# EAGLE schematic Phi (EAGLE 6.4)

## Sheet 1 of 2
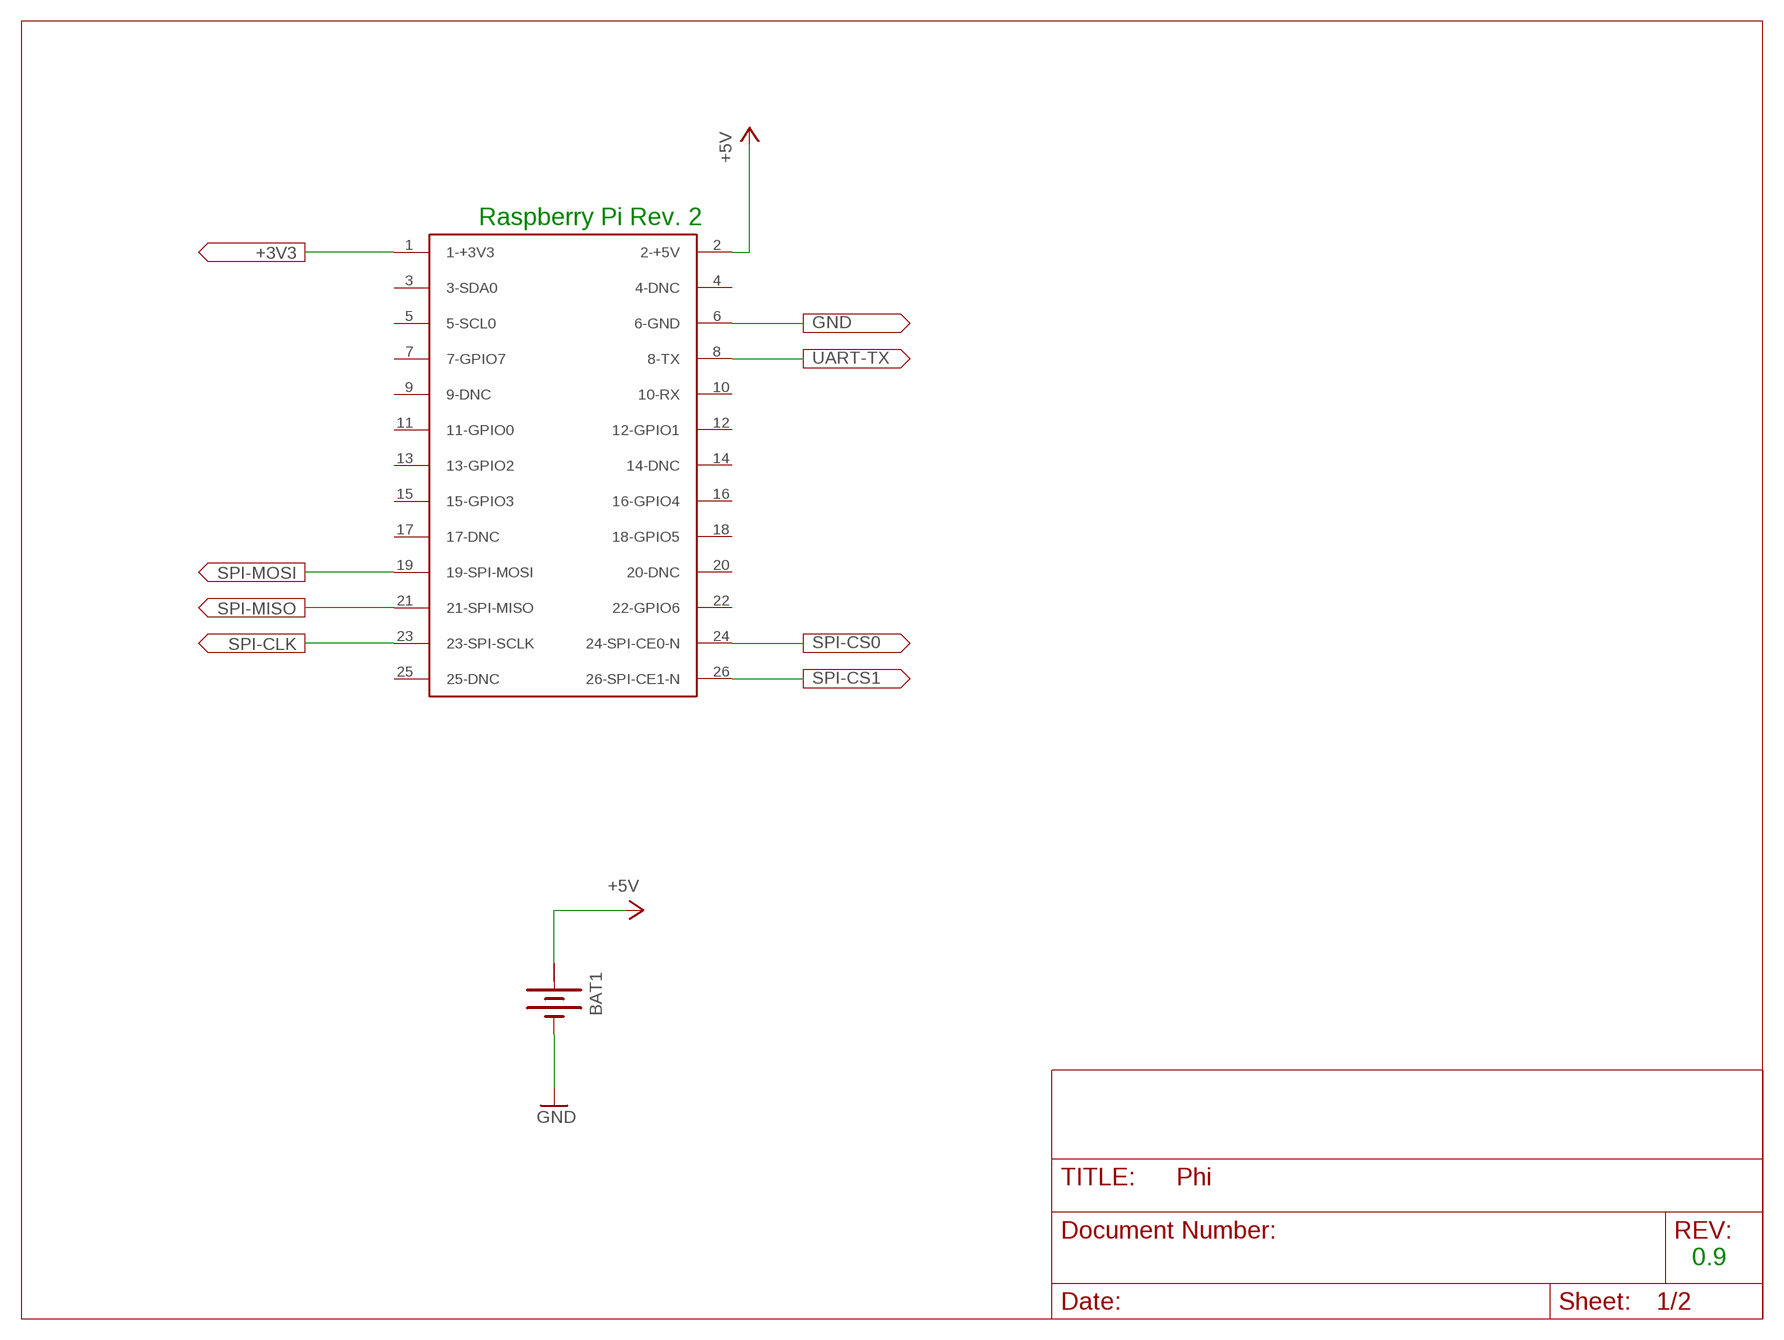
[diagram p0: schematic, sheet 1]

### Parts
BAT1  BATTERY  [BATTERY]
U$1  RASPBERRY-PI  [RASPBERRY-PI]

### Nets
+3V3: U$1.1(1-+3V3)
+5V: BAT1.+ U$1.2(2-+5V) ; also sheet 2
GND: BAT1.- ; also sheet 2
N$1: U$1.24(24-SPI-CE0-N)
N$3: U$1.26(26-SPI-CE1-N)
N$4: U$1.6(6-GND)
SPI-CLK: U$1.23(23-SPI-SCLK)
SPI-MISO: U$1.21(21-SPI-MISO)
SPI-MOSI: U$1.19(19-SPI-MOSI)
UART-TX: U$1.8(8-TX)
Unconnected: U$1.3(3-SDA0) U$1.4(4-DNC) U$1.5(5-SCL0) U$1.7(7-GPIO7) U$1.9(9-DNC) U$1.10(10-RX) U$1.11(11-GPIO0) U$1.12(12-GPIO1) U$1.13(13-GPIO2) U$1.14(14-DNC) U$1.15(15-GPIO3) U$1.16(16-GPIO4) U$1.17(17-DNC) U$1.18(18-GPIO5) U$1.20(20-DNC) U$1.22(22-GPIO6) U$1.25(25-DNC)

### Notes on the sheet
- Raspberry Pi Rev. 2
- 0.9

## Sheet 2 of 2
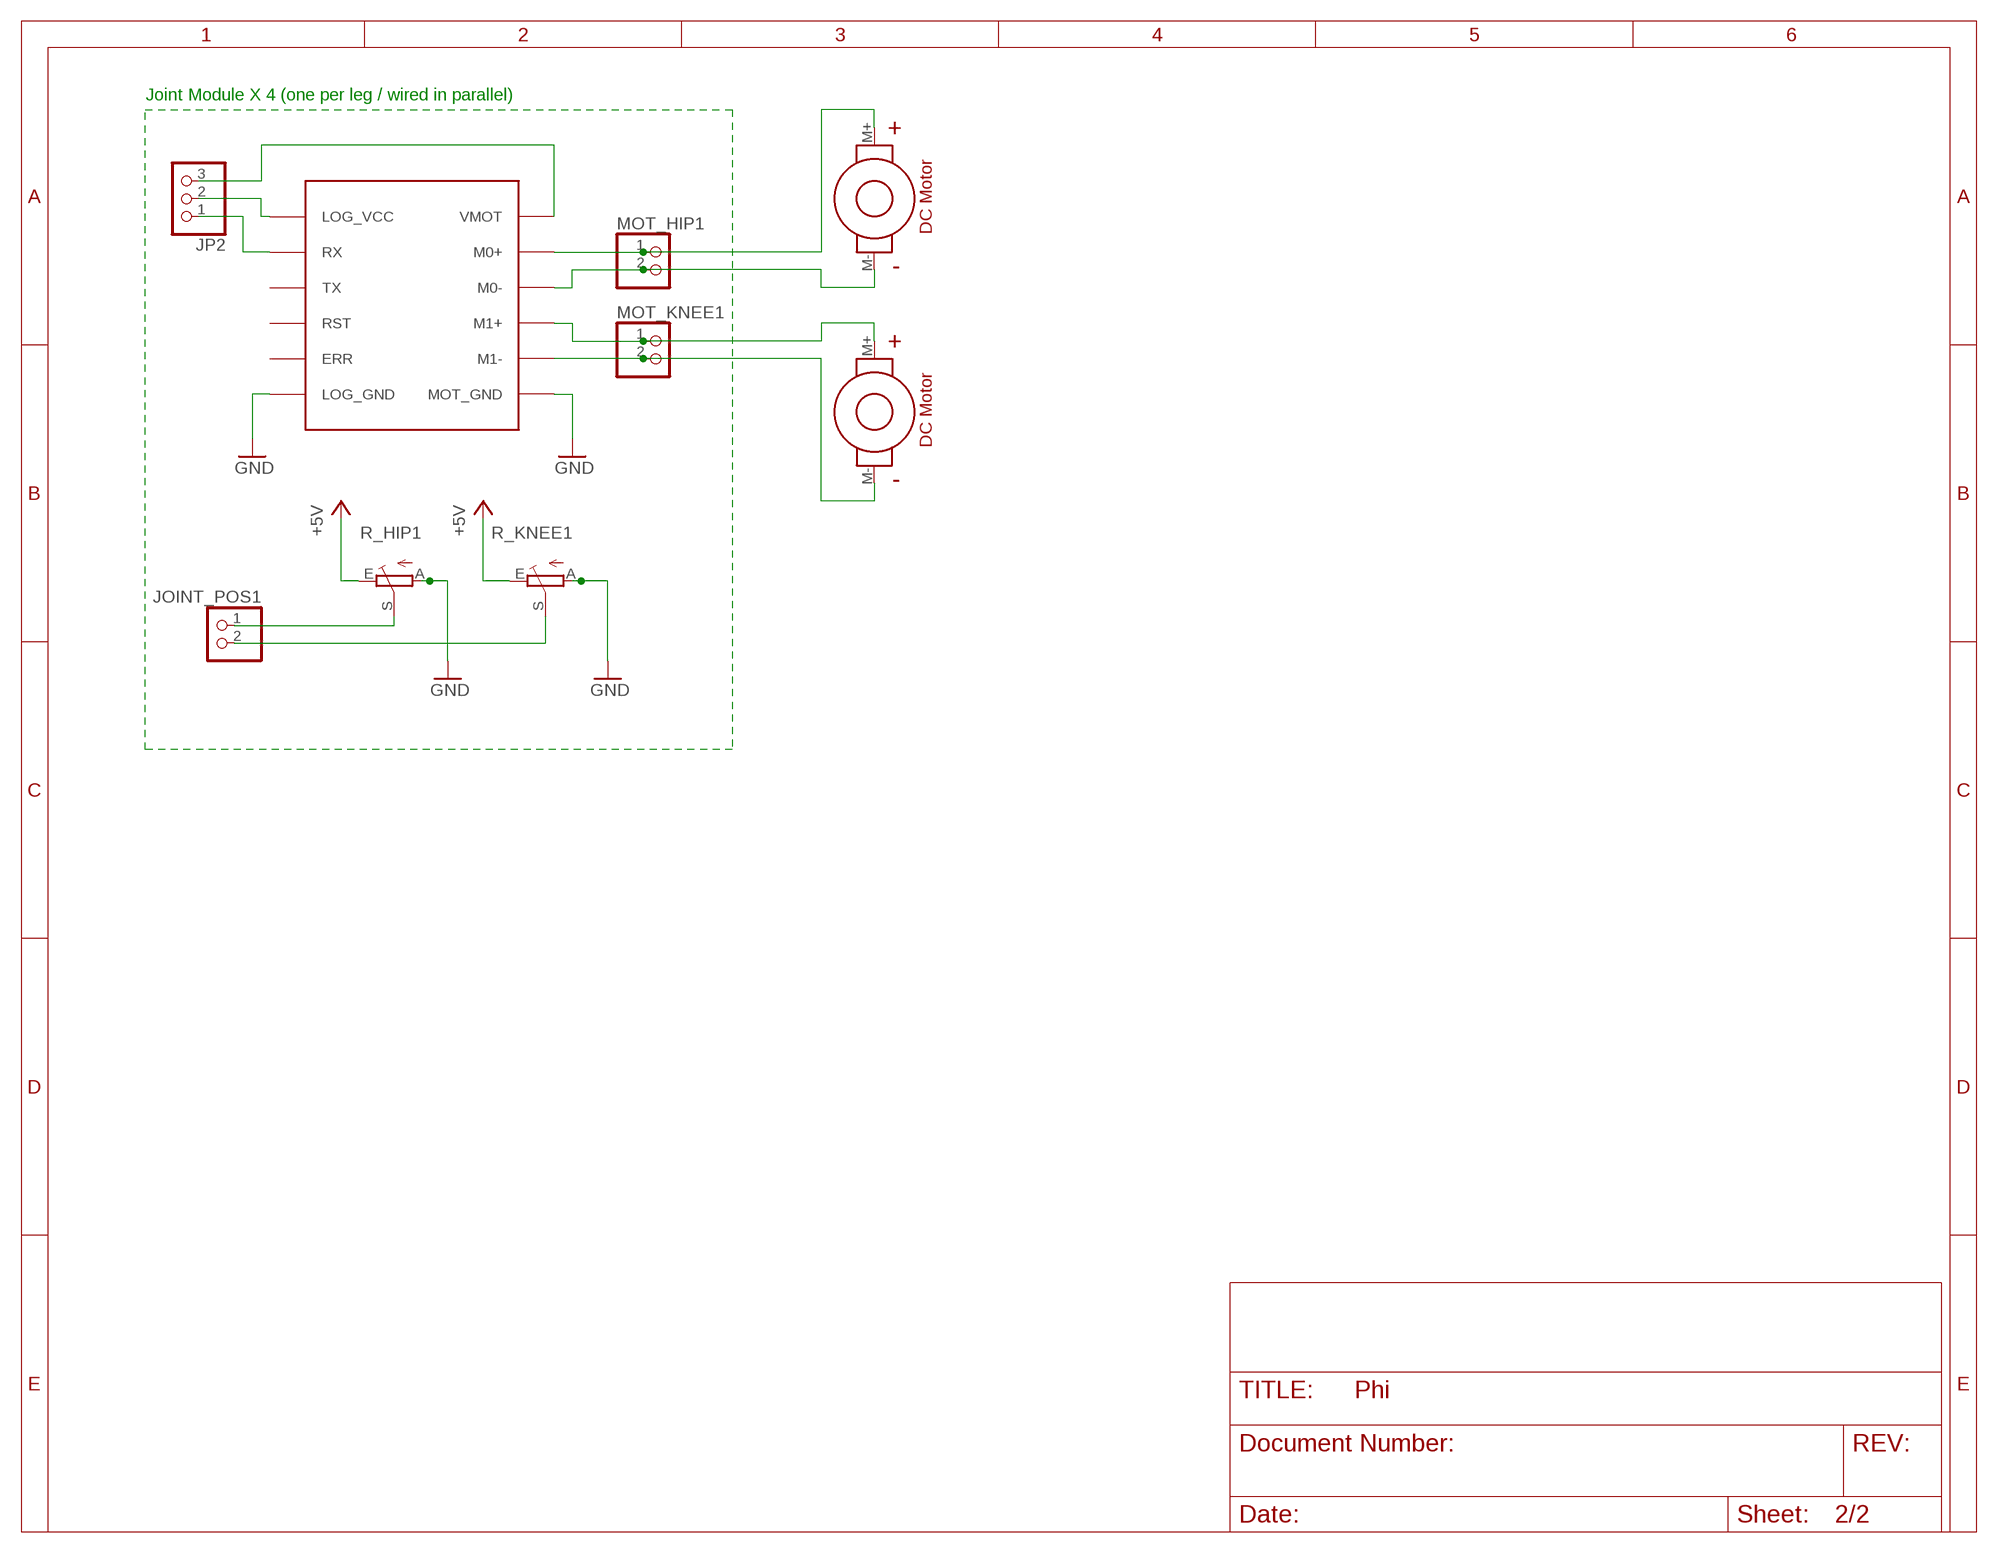
[diagram p1: schematic, sheet 2]

### Parts
JOINT_POS1  PINHD-1X2  [1X02]
JP2  PINHD-1X3  [1X03]
MOT_HIP1  PINHD-1X2  [1X02]
MOT_KNEE1  PINHD-1X2  [1X02]
R_HIP1  TRIM_EU-B25P  [B25P]
R_KNEE1  TRIM_EU-B25P  [B25P]
U$5  QIK_2S9V1  [QIK_2S9V1_BOARD]
U$6  DC-MOTOR  [DC-MOTOR]
U$7  DC-MOTOR  [DC-MOTOR]

### Nets
+3V1: JP2.2 U$5.VCC(LOG_VCC)
+5V: JP2.3 R_HIP1.E R_KNEE1.E U$5.VMOT ; also sheet 1
GND: R_HIP1.A R_KNEE1.A U$5.GND2(MOT_GND) U$5.GND(LOG_GND) ; also sheet 1
N$2: MOT_HIP1.2 U$5.M0- U$6.M-
N$9: MOT_KNEE1.1 U$5.M1+ U$7.M+
N$12: JOINT_POS1.2 R_KNEE1.S
N$13: MOT_KNEE1.2 U$5.M1- U$7.M-
N$14: MOT_HIP1.1 U$5.M0+ U$6.M+
N$15: JOINT_POS1.1 R_HIP1.S
TX/RX1: JP2.1 U$5.RX
Unconnected: U$5.ERR U$5.RST U$5.TX

### Notes on the sheet
- Joint Module X 4 (one per leg / wired in parallel)

## Power pins joined to a net without a drawn wire
+: BAT1.+@1(+)

## Library data of the parts
BAT1 = special:BATTERY: BATTERY
JOINT_POS1 MOT_HIP1 MOT_KNEE1 = pinhead:PINHD-1X2: PIN HEADER
JP2 = pinhead:PINHD-1X3: PIN HEADER
R_HIP1 R_KNEE1 = pot:TRIM_EU-: POTENTIOMETER
U$1 = RaspberryPi:RASPBERRY-PI: Raspberry Pi Board <http://www.raspberrypi.org/> Jacques Lagnel V1.0 (beta) 2012 Board dimension: Forum 3D model <http://www.raspberrypi.org/forum/general-discussion/mechanical-profile-3d-models?value=3d%20model&type=1&include=1&search=1&ret=all> The GPIO Connector (P1): http://elinux.org/RPi_Low-level_peripherals
U$5 = Misc-Phi-Comp:QIK_2S9V1: Polulu QIK 2S9V1 Motor Controller
U$6 U$7 = Misc-Phi-Comp:DC-MOTOR: DC Motor